# EAGLE design Addon-mapleCUx_Raspi-3V3-UART-CC2530-V012 (EAGLE 9.1.0)
MAPLE-CUx Large Version
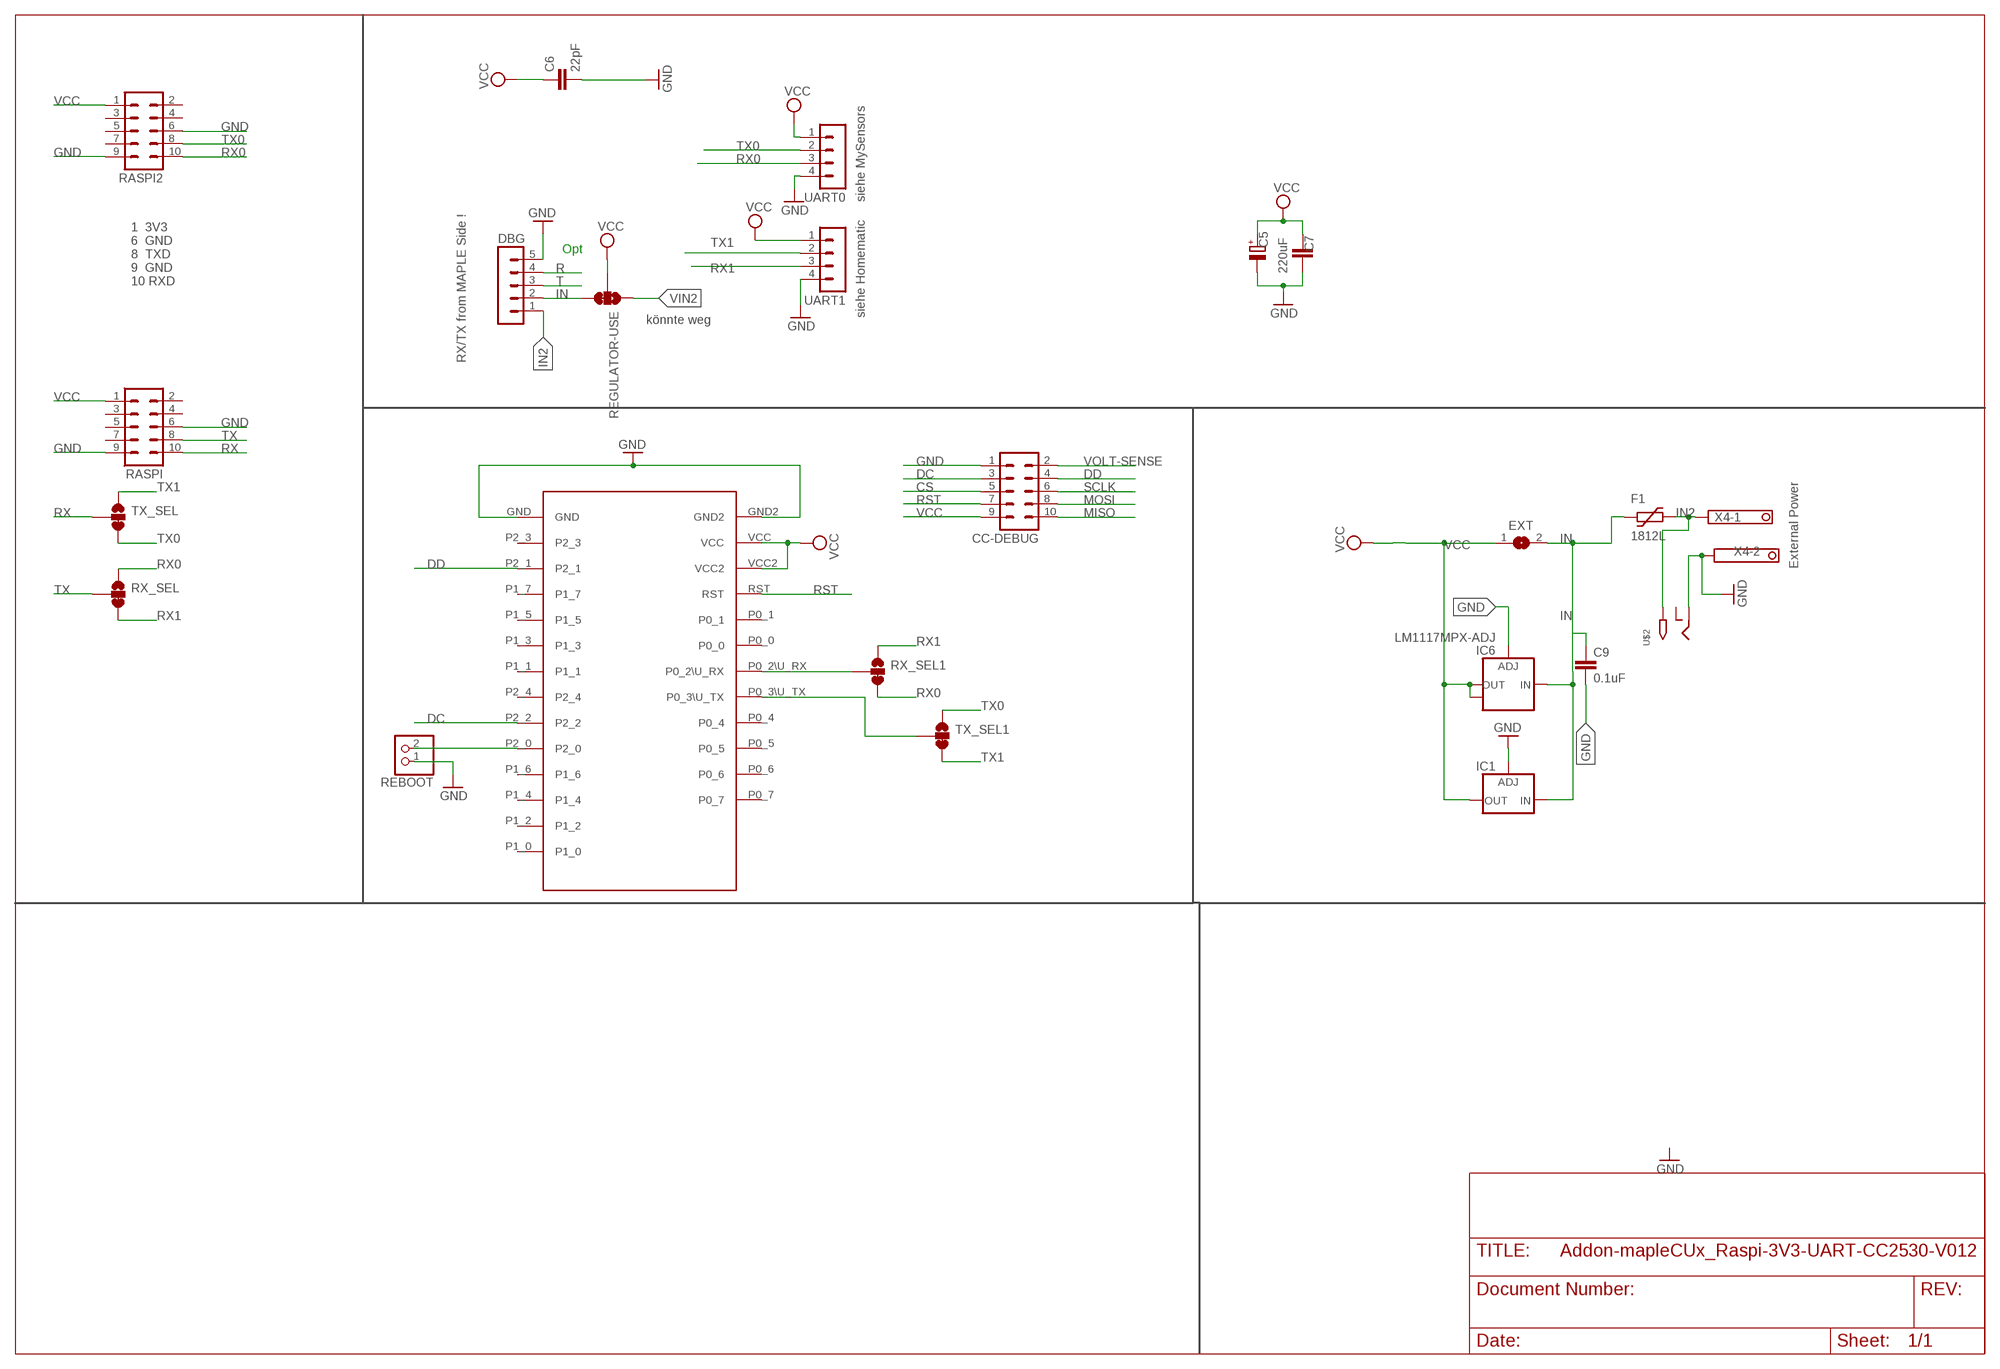
[diagram p0: schematic, sheet 1]

## Parts
C5  220uF  CPOL-EUE5-8.5  [E5-8,5]
C6  22pF  C-EUC0805  [C0805]
C7  C-EUC1812  [C1812]
C9  0.1uF  C-EUC1206  [C1206]
CC-DEBUG  MA05-2  [MA05-2]
DBG  MA05-1  [MA05-1]
EXT  SJ  [SJ]
F1  1812L  [1812L]
IC1  LD117ADT50TR  [DPACK]
IC6  LM1117MPX-ADJ  [SOT223]
RASPI  MA05-2  [MA05-2]
RASPI2  MA05-2  [MA05-2]
REBOOT  PINHD-1X2  [1X02]
REGULATOR-USE  JUMPER-SMT_3_1-NC_TRACE_SILK  [SMT-JUMPER_3_1-NC_TRACE_SILK]
RX_SEL  JUMPER-SMT_3_1-NC_TRACE_SILK  [SMT-JUMPER_3_1-NC_TRACE_SILK]
RX_SEL1  JUMPER-SMT_3_1-NC_TRACE_SILK  [SMT-JUMPER_3_1-NC_TRACE_SILK]
TX_SEL  JUMPER-SMT_3_1-NC_TRACE_SILK  [SMT-JUMPER_3_1-NC_TRACE_SILK]
TX_SEL1  JUMPER-SMT_3_1-NC_TRACE_SILK  [SMT-JUMPER_3_1-NC_TRACE_SILK]
U$2  2.1MMJACKTHM  [PJ-102A]
U$3  CC2530_MODULE  [CC2530_DIL]
UART0  MA04-1  [MA04-1]
UART1  MA04-1  [MA04-1]
X4  1751248  [1751248]

## Nets
CS: CC-DEBUG.5
DC: CC-DEBUG.3 U$3.P2_2
DD: CC-DEBUG.4 U$3.P2_1
GND [PWR]: C5.- C6.2 C7.1 C9.2 CC-DEBUG.1 DBG.5 IC1.1(ADJ) IC6.1(ADJ) RASPI2.6 RASPI2.9 RASPI.6 RASPI.9 REBOOT.1 U$2.RING U$3.GND U$3.GND2 UART0.4 UART1.4 X4.2
IN [PWR]: C9.1 DBG.2 EXT.2 F1.P$1 IC1.3(IN) IC6.3(IN) REGULATOR-USE.3
IN2 [PWR]: DBG.1 F1.P$2 U$2.TIP X4.1
MISO: CC-DEBUG.10
MOSI: CC-DEBUG.8
N$1: REBOOT.2 U$3.P2_0
N$2: RX_SEL1.2 U$3.P0_2\U_RX
N$3: TX_SEL1.2 U$3.P0_3\U_TX
R: DBG.4
RST: CC-DEBUG.7 U$3.RST
RX: RASPI.10 TX_SEL.2
RX0: RASPI2.10 RX_SEL1.3 RX_SEL.1 UART0.3
RX1: RX_SEL1.1 RX_SEL.3 UART1.3
SCLK: CC-DEBUG.6
T: DBG.3
TX: RASPI.8 RX_SEL.2
TX0: RASPI2.8 TX_SEL1.1 TX_SEL.3 UART0.2
TX1: TX_SEL1.3 TX_SEL.1 UART1.2
VCC [PWR]: C5.+ C6.1 C7.2 CC-DEBUG.9 EXT.1 IC1.4(OUT) IC6.2(OUT) IC6.TAB(OUT1) RASPI2.1 RASPI.1 REGULATOR-USE.2 U$3.VCC U$3.VCC2 UART0.1 UART1.1
VIN2 [PWR]: REGULATOR-USE.1
VOLT-SENSE: CC-DEBUG.2
Unconnected: RASPI2.2 RASPI2.3 RASPI2.4 RASPI2.5 RASPI2.7 RASPI.2 RASPI.3 RASPI.4 RASPI.5 RASPI.7 U$2.RING_SW U$3.P0_0 U$3.P0_1 U$3.P0_4 U$3.P0_5 U$3.P0_6 U$3.P0_7 U$3.P1_0 U$3.P1_1 U$3.P1_2 U$3.P1_3 U$3.P1_4 U$3.P1_5 U$3.P1_6 U$3.P1_7 U$3.P2_3 U$3.P2_4

## Notes on the sheet
- siehe MySensors
- Opt
- 1  3V3
  6  GND
  8  TXD
  9  GND
  10 RXD
- siehe Homematic
- könnte weg
- RX/TX from MAPLE Side !
- External Power

## Library data of the parts
C5 = rcl:CPOL-EU: POLARIZED CAPACITOR, European symbol; SPICEPREFIX: C
C6 C7 C9 = rcl:C-EU: CAPACITOR, European symbol; SPICEPREFIX: C
CC-DEBUG RASPI RASPI2 = con-lstb:MA05-2: PIN HEADER; OC_FARNELL: unknown; OC_NEWARK: unknown
DBG = con-lstb:MA05-1: PIN HEADER; OC_FARNELL: unknown; OC_NEWARK: unknown
EXT = jumper:SJ: SMD solder JUMPER
F1 = ptc-littlefuse:1812L
IC1 = v-reg:LD117A?*: Low drop fixed and adjustable positive voltage regulators 1 A Source: http://www.st.com/stonline/products/literature/ds/7194/ld1117axx.pdf
IC6 = lm1117:LM1117MPX-ADJ
REBOOT = pinhead:PINHD-1X2: PIN HEADER
REGULATOR-USE RX_SEL RX_SEL1 TX_SEL TX_SEL1 = SparkFun-Jumpers:JUMPER-SMT_3_1-NC_TRACE: Normally closed trace jumper (1 of 2 connections) This jumper has a trace between two pads so it's normally closed (NC). The other connection is normally open (NO). Use a razor knife to open the connection. For best results follow the IPC guidelines for cutting traces: Cutout at least 0.063 mm (0.005 in). Remove all loose material to clean up the cut area. Seal the cut with an approved epoxy. Reapply solder to reclose the connection, or to close the NO connection.
U$2 = adafruit:2.1MMJACK: 2.1mm x 5.5mm THM DC jack with internal switch. Digikey part #PJ-102A, 4UCON part #05537 2.1mm x 5.5mm SMT DC jack with internal switch. Digikey part #PJ-002A-SMT, 4UCON part #03267 By microbuilder.eu & adafruit.com
U$3 = Martin-Communication-V3:CC2530_MODULE
UART0 UART1 = con-lstb:MA04-1: PIN HEADER; OC_FARNELL: unknown; OC_NEWARK: unknown
X4 = con-phoenix-350:1751248: MKDS 1/ 2-3,5 Printklemme Nennstrom: 10 A Bemessungsspannung: 160 V Raster: 3,5 mm Polzahl: 2 Montageart: Löten Anschlussart: Schraubanschluss Anschlussrichtung vom Leiter zur Platine: 0° Source: http://eshop.phoenixcontact.com .. 1751248.pdf; OC_FARNELL: unknown; OC_NEWARK: unknown

## Net classes
0 default: width 0.305 mm
1 PWR: width 0.914 mm

## Board
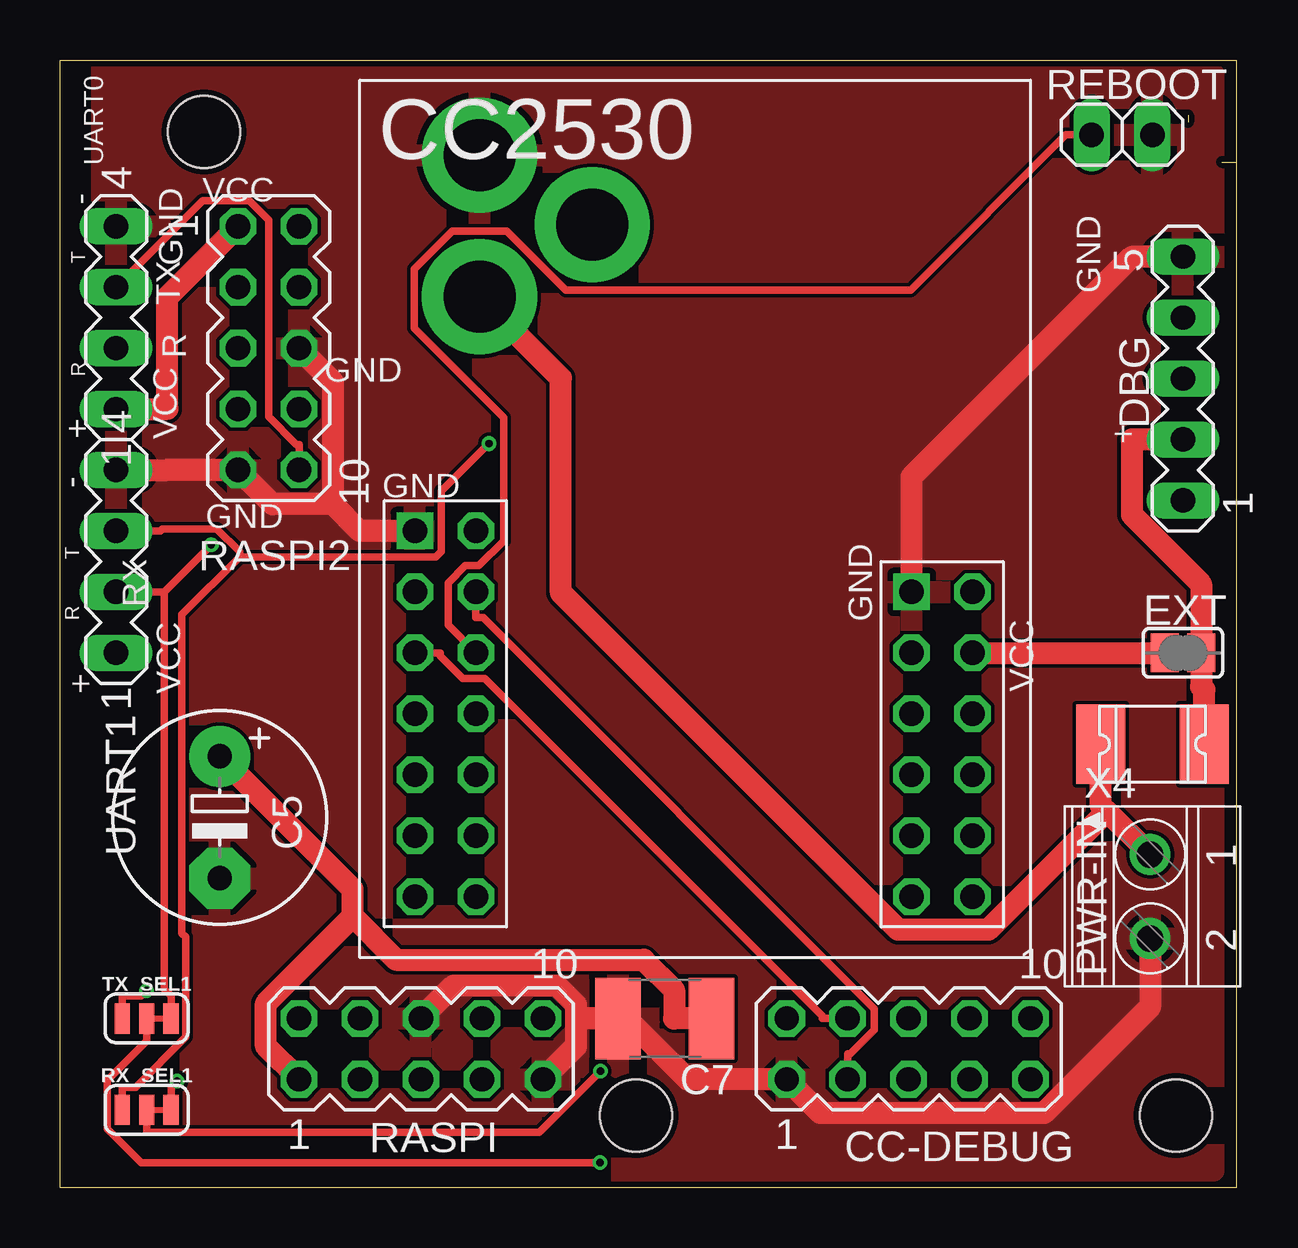
[diagram p1: board, top side]
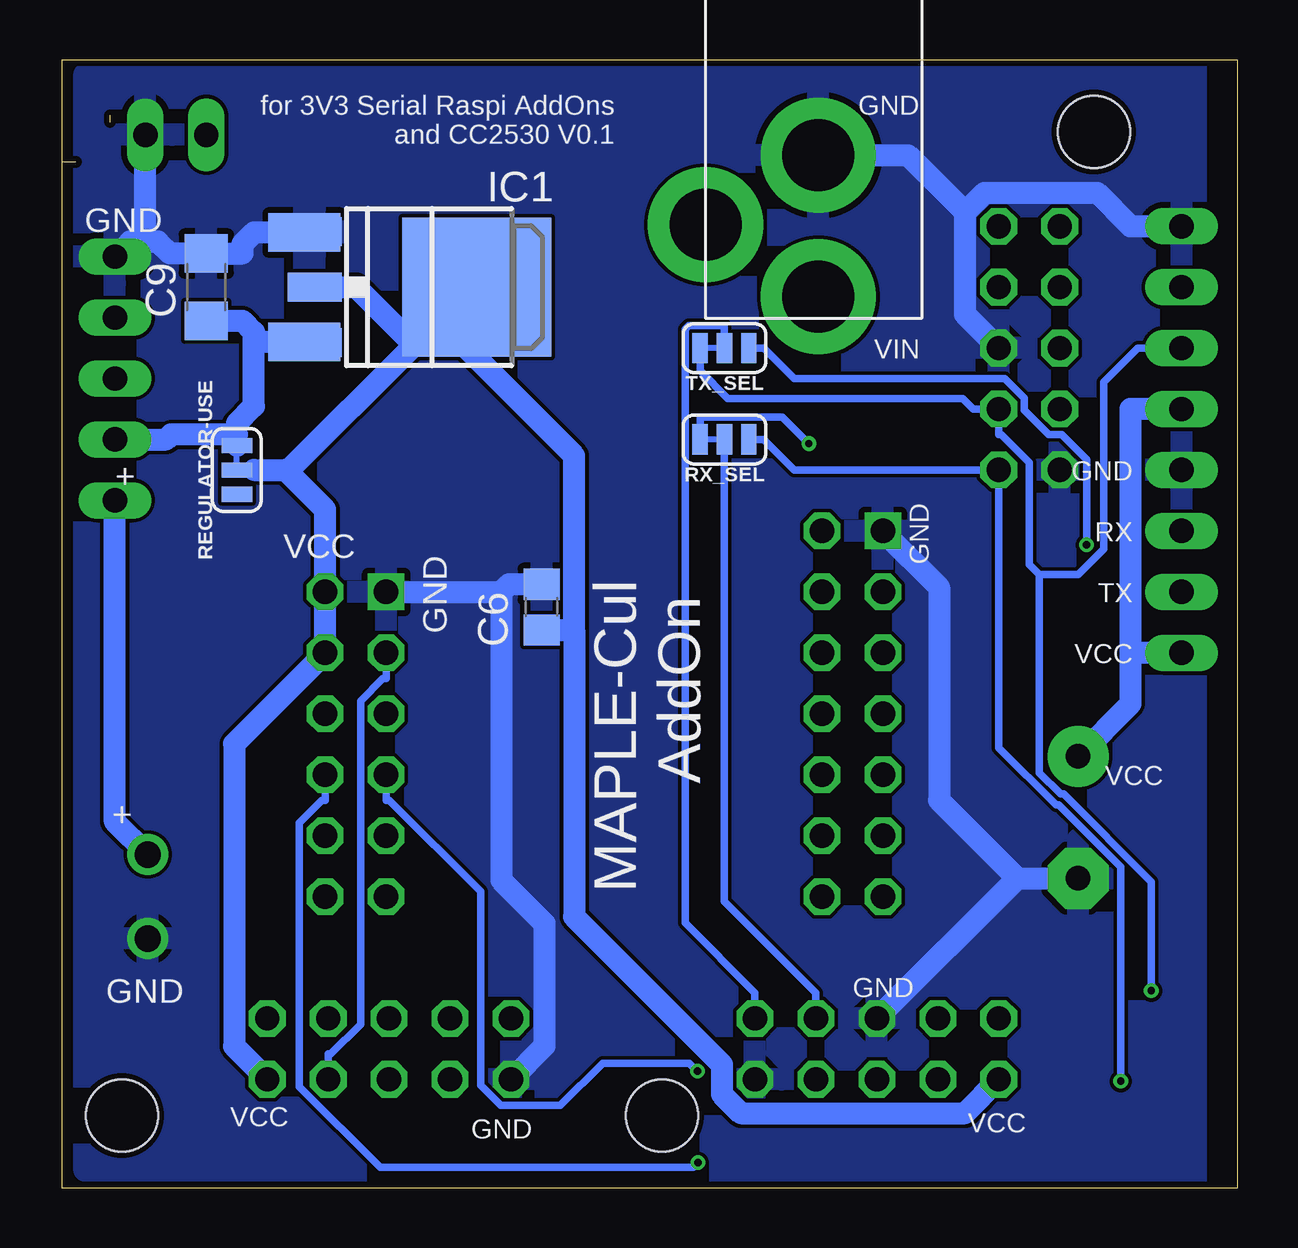
[diagram p2: board, bottom side, seen from below]

Size 49 x 47 mm. Coordinates in mm from the lower left corner, seen from the top.
Outline: 49,47 49,46.24
Outline: 47,44.7 47,44.41
Outline: 48.41,42.75 49,42.75
Outline: 49,47 0,47 0,0 49,0 49,42.75
Outline: 49,47 49,42.75
Copper layers (1*16): Top 0.035mm / dielectric 1.5mm / Bottom 0.035mm
Design rules "SeeedStudio_2layer_DRU_no_angle_20140221": minimum track width 6mil, minimum drill 12mil, track to track 6mil, track to pad 6mil, pad to pad 6mil, via to via 6mil, smd to smd 0mil, copper to edge 10mil, drill to drill 10mil, minimum pad ring 10mil, minimum via ring 6mil, stop-mask expansion 2mil, vias tented up to drill 100mil, thermal gap 10mil
Holes 3 mm at 6,44 24,3 46.5,3
tRestrict: area 0.4,2 to 1.1,47.1
bRestrict: area 0.4,0.7 to 1.1,46.4

### Footprints (pad centres in the part's own frame; a part is rotated, then mirrored left to right if it is on the bottom)
E5-8,5 = drill 1.016 pad 2.54: + -2.54,0 | drill 1.016 pad 2.54 octagon: - 2.54,0
C0805 = smd 1.3 x 1.5: 1 -0.95,0; 2 0.95,0
C1812 = smd 1.9 x 3.4: 1 -1.95,0; 2 1.95,0
C1206 = smd 1.6 x 1.8: 1 -1.4,0; 2 1.4,0
MA05-2 = drill 1.016 octagon: 1 -5.08,-1.27; 2 -5.08,1.27; 3 -2.54,-1.27; 4 -2.54,1.27; 5 0,-1.27; 6 0,1.27; 7 2.54,-1.27; 8 2.54,1.27; 9 5.08,-1.27; 10 5.08,1.27
MA05-1 = drill 1.016 long: 1 -5.08,0; 2 -2.54,0; 3 0,0; 4 2.54,0; 5 5.08,0
SJ = smd 1.168 x 1.6: 1 -0.762,0; 2 0.762,0
1812L = smd 2.03 x 3.3: P$1 -2.16,0; P$2 2.16,0
DPACK = smd 1.6 x 3: 1 -2.28,-4.8; 3 2.28,-4.8 | smd 5.8 x 6.2: 4 0,2.38
SOT223 = smd 1.219 x 2.235: 1 -2.311,-3.099; 2 0,-3.099; 3 2.311,-3.099 | smd 3.6 x 2.2: TAB 0,3.099
1X02 = drill 1.016 long: 1 -1.27,0; 2 1.27,0
SMT-JUMPER_3_1-NC_TRACE_SILK = smd 0.635 x 1.27: 1 -1.016,0; 2 0,0; 3 1.016,0
PJ-102A = drill 3 pad 4.8: RING 0.1,-3.39; RING_SW -4.6,-6.29; TIP 0.1,-9.29
CC2530_DIL = drill 1.016 square: GND -11.684,-1.27; GND2 9.017,-3.81 | drill 1.016 octagon: P0_0 9.017,-8.89; P0_1 11.557,-8.89; P0_2\U_RX 9.017,-11.43; P0_3\U_TX 11.557,-11.43; P0_4 9.017,-13.97; P0_5 11.557,-13.97; P0_6 9.017,-16.51; P0_7 11.557,-16.51; P1_0 -9.144,-16.51; P1_1 -11.684,-16.51; P1_2 -9.144,-13.97; P1_3 -11.684,-13.97; P1_4 -9.144,-11.43; P1_5 -11.684,-11.43; P1_6 -9.144,-8.89; P1_7 -11.684,-8.89; P2_0 -9.144,-6.35; P2_1 -11.684,-6.35; P2_2 -9.144,-3.81; P2_3 -11.684,-3.81; P2_4 -9.144,-1.27; RST 9.017,-6.35; VCC 11.557,-3.81; VCC2 11.557,-6.35
MA04-1 = drill 1.016 long: 1 -3.81,0; 2 -1.27,0; 3 1.27,0; 4 3.81,0
1751248 = drill 1.1 pad 1.7: 1 -1.75,-0.1; 2 1.75,-0.1

### Placement (x,y rotation side)
C5  6.66,15.43 270 top
C6  29.01,24.2 90 bottom
C7  25.2,7.05 0 top
C9  42.98,37.53 90 bottom
CC-DEBUG  35.36,5.78 0 top
DBG  46.79,33.72 90 top
EXT  46.79,22.29 0 top
F1  45.52,18.48 180 top
IC1  34.09,37.53 270 bottom
IC6  35.36,37.53 270 bottom
RASPI  15.04,5.78 0 top
RASPI2  8.69,34.99 270 top
REBOOT  44.25,43.88 180 top
REGULATOR-USE  41.71,29.91 90 bottom
RX_SEL  21.39,31.18 180 bottom
RX_SEL1  3.61,3.24 0 top
TX_SEL  21.39,34.99 180 bottom
TX_SEL1  3.61,7.05 0 top
U$2  17.58,46.42 0 bottom
U$3  26.47,28.64 0 top
UART0  2.34,36.26 90 top
UART1  2.34,26.1 90 top
X4  45.52,12.13 270 top

### Tracks (layer width: path | path; a pad name or v marks a point on that pad's centre or on a via)
DC
  Top 0.305: CC-DEBUG.3 32.82,5.58 32.93,5.58 33.93,6.58 33.93,7.46 17.63,23.76 17.33,23.76 U$3.P2_2
DD
  Top 0.305: CC-DEBUG.4 31.75,7.05 31.75,7.16 17.69,21.22 16.79,21.22 15.85,22.16 15.85,22.29 U$3.P2_1
GND
  Top 0.914: X4.2 45.42,7.53 40.99,3.1 31.69,3.1 CC-DEBUG.1 26.16,4.51 23.62,7.05 C7.1 21.69,7.05 21.49,7.05 | DBG.5 44.66,38.8 35.49,29.63 U$3.GND2 | U$3.GND 12.49,27.37 11.38,28.48 | 21.49,7.05 21.49,5.88 RASPI.9 | RASPI.6 16.41,8.42 20.69,8.42 21.49,7.62 21.49,7.05 | 11.38,28.48 11.38,33.57 RASPI2.6 | 11.38,28.48 8.85,28.48 RASPI2.9 4.47,29.91 UART1.4
  Bottom 0.914: 30.68,24.83 30.37,25.14 C6.2 | U$3.GND2 30.68,24.83 | 30.68,24.83 30.68,12.81 28.89,11.02 28.89,5.9 CC-DEBUG.1 | U$2.RING 13.74,43.03 11.36,40.65 | 9.2,12.89 C5.- | RASPI.6 9.2,12.89 | U$3.GND 12.45,25.03 12.45,16.14 9.2,12.89 | 45.52,39.44 44.99,39.44 44.49,38.93 C9.2 41.47,38.93 41.47,39.34 41,39.81 IC1.1 38.49,39.81 IC6.1 | DBG.5 46.16,39.44 45.52,39.44 | 45.52,39.44 REBOOT.1 | RASPI2.6 11.36,36.39 11.36,40.65 | 11.36,40.65 10.55,41.46 5.87,41.46 4.47,40.07 UART0.4
  pour Top: 1.07,46.42 48.06,46.42 48.06,0.7 1.07,0.7
  pour Bottom: 1.07,46.42 1.07,0.7 48.06,0.7 48.06,46.42
IN
  Top 0.914: F1.P$1 47.68,20.74 47.55,20.87 EXT.2 47.55,25.15 44.66,28.04 44.66,31.18 DBG.2
  Bottom 0.914: DBG.2 44.66,31.18 44.45,31.39 41.71,31.39 | 41.71,31.39 41.71,31.85 41,32.56 41,35.25 | REGULATOR-USE.3 41.71,31.39 | 41,35.25 IC1.3 38.49,35.25 IC6.3 | C9.1 41.47,36.13 41,35.66 41,35.25
IN2
  Top 0.914: 43.62,15.68 38.68,10.75 34.92,10.75 20.87,24.8 20.87,33.74 U$2.TIP | X4.1 43.62,15.68 | 43.62,15.68 43.36,15.94 F1.P$2
  Bottom 0.914: X4.1 46.79,15.25 DBG.1
N$1
  Top 0.305: U$3.P2_0 16.18,23.44 16.18,25.21 16.89,25.93 17.46,25.93 18.49,26.96 18.49,32.1 14.76,35.83 14.76,38.28 16.35,39.86 18.62,39.86 21.08,37.41 35.44,37.41 41.91,43.88 REBOOT.2
N$2  (via drill 0.3 pad 0.61)
  Top 0.305: RX_SEL1.2 3.61,2.3 19.96,2.3 v22.52,4.85
  Bottom 0.305: U$3.P0_2\U_RX 35.49,16.14 35.35,16.14 31.55,12.34 31.55,4.26 30.7,3.42 28.24,3.42 26.47,5.18 22.85,5.18 v22.52,4.85
N$3  (via drill 0.3 pad 0.61)
  Top 0.305: v22.5,1.04 3.38,1.04 1.97,2.44 1.97,4.47 3.61,6.11 TX_SEL1.2
  Bottom 0.305: U$3.P0_3\U_TX 38.03,16.14 38.16,16.14 39.11,15.2 39.11,4.21 35.74,0.84 22.69,0.84 v22.5,1.04
RST
  Bottom 0.305: CC-DEBUG.7 37.9,5.58 37.79,5.58 36.55,6.81 36.55,20.29 35.62,21.22 35.49,21.22 U$3.RST
RX
  Bottom 0.305: RASPI.10 20.12,8.12 23.03,11.03 23.03,35.78 22.88,35.93 21.39,35.93 TX_SEL.2
RX0  (via drill 0.3 pad 0.61)
  Top 0.305: RX_SEL1.3 4.63,4.18 v4.88,4.43 | RASPI2.10 9.96,30.98 9.85,30.98 8.69,32.14 8.69,40.33 7.88,41.14 5.95,41.14 UART0.3
  Bottom 0.305: v4.88,4.43 4.88,13.36 7.46,15.94 7.57,15.94 9.96,18.33 RASPI2.10 18.48,29.91 19.75,31.18 RX_SEL.1
RX1  (via drill 0.3 pad 0.61)
  Top 0.305: 7.49,26.28 7.49,26.5 6.54,27.45 4.25,27.45 4.17,27.37 UART1.3 | 7.49,26.28 5.08,23.88 5.08,10.6 5.25,10.44 5.25,6.28 3.15,4.18 2.59,4.18 RX_SEL1.1 | 7.49,26.28 15.67,26.28 15.89,26.51 15.89,29.03 v17.87,31.01
  Bottom 0.305: RX_SEL.3 22.41,32.12 18.99,32.12 v17.87,31.01
TX
  Bottom 0.305: RASPI.8 17.58,8.12 21.39,11.93 RX_SEL.2
TX0  (via drill 0.3 pad 0.61)
  Top 0.305: TX_SEL1.1 2.59,7.99 3.39,7.99 v3.6,8.2
  Bottom 0.305: 8.27,25.55 8.69,25.98 8.69,30.22 9.85,31.38 9.96,31.38 RASPI2.8 11.03,32.45 11.47,32.89 21.25,32.89 22.41,34.05 TX_SEL.3 | 8.27,25.55 8.27,17.29 7.38,16.4 7.26,16.4 3.6,12.74 v3.6,8.2 | 8.27,25.55 6.64,25.55 5.59,26.61 5.59,33.57 4.17,34.99 UART0.2
TX1  (via drill 0.3 pad 0.61)
  Top 0.305: 4.35,24.83 v6.3,26.79 | v6.3,26.79 | 4.35,24.83 4.05,24.83 UART1.2 | 4.35,24.83 4.35,8.27 4.63,7.99 TX_SEL1.3
  Bottom 0.305: v6.3,26.79 6.3,30.35 7.33,31.38 7.87,31.38 8.89,32.4 8.89,32.9 9.71,33.73 18.49,33.73 19.75,34.99 TX_SEL.1
VCC
  Top 0.914: UART0.1 4.47,32.45 4.47,37.12 RASPI2.1 | 12.2,11.29 13.99,9.49 24.33,9.49 25.59,8.24 25.59,7.05 C7.2 | RASPI.1 8.57,5.89 8.57,7.67 12.2,11.29 | 12.2,11.29 12.2,12.43 C5.+ | U$3.VCC2 EXT.1
  Bottom 0.635: 41,29.91 REGULATOR-USE.2
  Bottom 0.914: 27.65,23.25 27.65,11.29 21.49,5.13 21.49,3.89 20.71,3.1 11.37,3.1 RASPI.1 | 27.65,23.25 27.65,30.51 32.26,35.12 | C6.1 27.65,23.25 | 39.6,29.84 34.32,35.12 | 39.6,29.84 38.03,28.27 38.03,26.2 U$3.VCC U$3.VCC2 41.82,18.5 41.82,5.89 CC-DEBUG.9 | 41,29.91 39.67,29.91 39.6,29.84 | IC1.4 IC6.TAB 32.26,35.12 | 34.32,35.12 36.73,37.53 IC6.2 | 32.26,35.12 34.32,35.12 | UART0.1 4.47,32.45 4.47,22.29 | UART1.1 4.47,22.29 | 4.47,22.29 4.47,20.16 C5.+

### Text on the board
tNames: GND | VCC | - | T | TX | GND | R | R | GND | + | VCC | + | - | GND | GND | T | R | RX | VCC | GND | VCC | + | PWR-IN
bNames: GND | for 3V3 Serial Raspi AddOns / and CC2530 V0.1 | GND | VIN | GND | + | RX | VCC | GND | GND | TX | MAPLE-Cul / AddOn | VCC | VCC | + | GND | GND | VCC | GND | VCC